# Altium schematic sheet power_ebox.SchDoc
size A; SheetNumber: 2; SheetTotal: 2
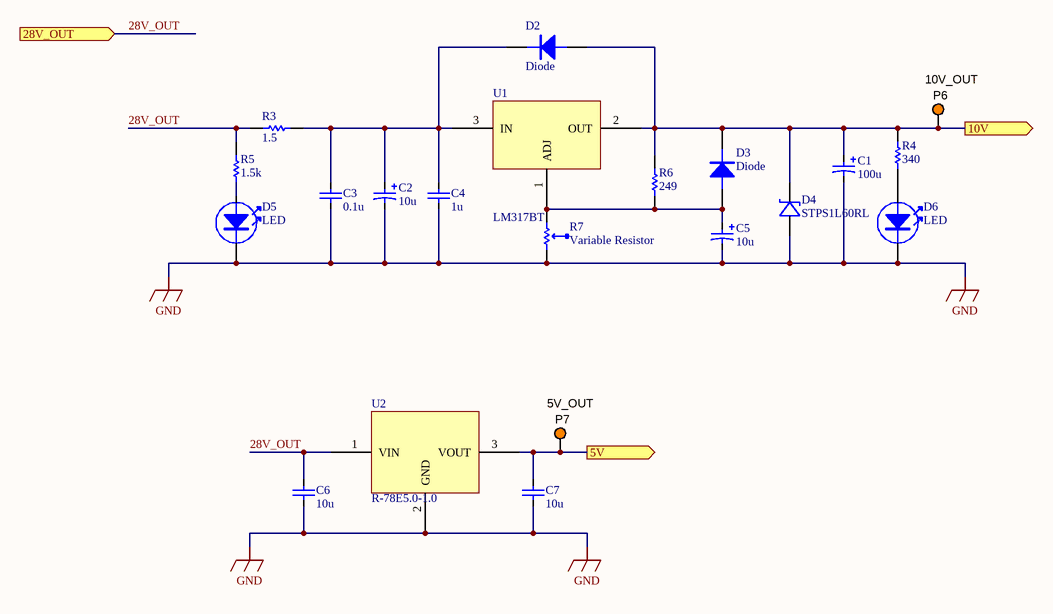
[diagram p0: power_ebox.SchDoc]

## Parts
C1  100u  [100uF Tantalum]
C2  10u  [10uF Tantalum]
C3  0.1u  [0.1uF Cer SMD]
C4  1u  [1uF]
C5  10u  [10uF Electrolytic]
C6  10u  [10uF Cer SMD]
C7  10u  [10uF Cer SMD]
D2  Diode  [Protective Diode]
D3  Diode  [Protective Diode]
D4  STPS1L60RL  [Schottky]
D5  LED  [LED 12V Thru Hole]
D6  LED  [LED 5V Thru Hole]
P6  10V_OUT  [KSTN-5003]
P7  5V_OUT  [KSTN-5003]
R3  1.5  [1.5 Ohm]
R4  340  [340 Ohm]
R5  1.5k  [General Resistor]
R6  249  [249 Ohm]
R7  Variable Resistor  [General Resistor]
U1  LM317BT  [LM317(B)T]
U2  R-78E5.0-1.0  [Step-Down Converter]

## Ports
5V (out), 10V (out), 28V_OUT (in)

## Nets
GND: C1.2 C2.2 C3.1 C4.1 C5.2 C6.1 C7.1 D4.1 D5.2 D6.2 R7.2 U2.2(GND)
5V: C7.2 P7.1 U2.3(VOUT) ; port 5V
10V: C1.1 D2.1 D3.2 D4.2 P6.1 R4.1 R6.1 U1.2(OUT) ; port 10V
28V_OUT: C6.2 R3.2 R5.1 U2.1(VIN) ; port 28V_OUT
NetC2_1: C2.1 C3.2 C4.2 D2.2 R3.1 U1.3(IN)
NetC5_1: C5.1 D3.1 R6.2 R7.1 U1.1(ADJ)
NetD5_1: D5.1 R5.2
NetD6_1: D6.1 R4.2

## Library data of the parts
C1 C2 = Capacitor - Polarized
C3 C4 C6 C7 = Capacitor - Ceramic
C5 = Capacitor - Polarized: Electrolytic
D4 = Schottky: Mfr_Name: STMicroelectronics; Type: DEV; Copyright: Copyright (C) 2021 Ultra Librarian. All rights reserved.; Manufacturer_Part_Number: STPS1L60RL; Digi-Key_Part_Number_1: 497-16205-2-ND; Digi-Key_Part_Number_2: 497-16205-1-ND; RefDes: RefDes
P6 P7 = CMP-002-00037-2: Test Point, Orange, Height 4.6 mm, Tail Length 3 mm, 1-Pin THD, RoHS; Manufacturer: Keystone; Colour: Orange; Packaging: Bulk; Package Description: 1-Pin Through Hole Device, Dia 2.54 mm; Pins: 1; Package Reference: 5003; Datasheet Version: Jun-15; Case/Package: 5003; Mounting Technology: TH; Connector Type: TestPoint; Diameter: 2.54mm; Contact Material: Bronze; Datasheet URL: http://keyelco.com/userAssets/file/M65p56.pdf; Manufacturer URL: http://www.keyelco.com/; Package Quantity: 10; Contact Plating: Tin; RoHS Compliant: True
R3-R6 = Resistor
U1 = Linear Regulator
U2 = Step-down Converter